# EAGLE board dsp_board_power_amplifier (EAGLE 9.6.2), part 1 of 2
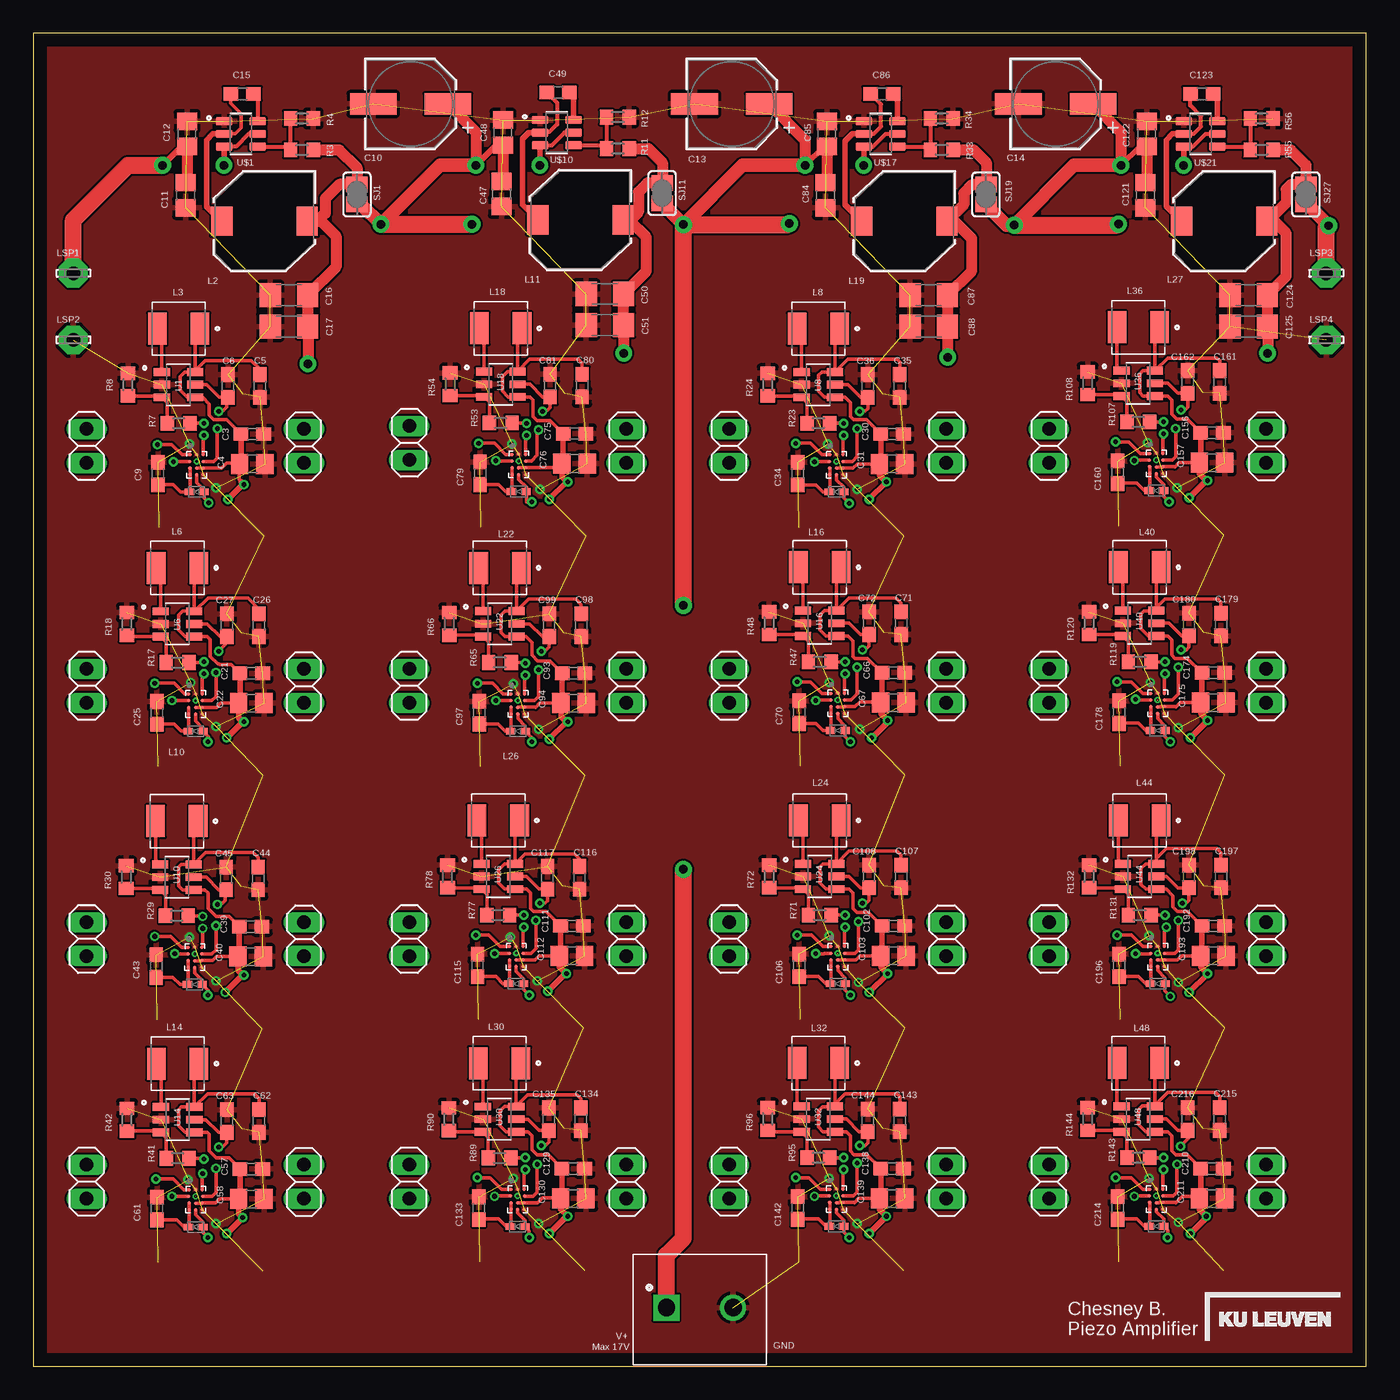
[diagram p7: board, top side]
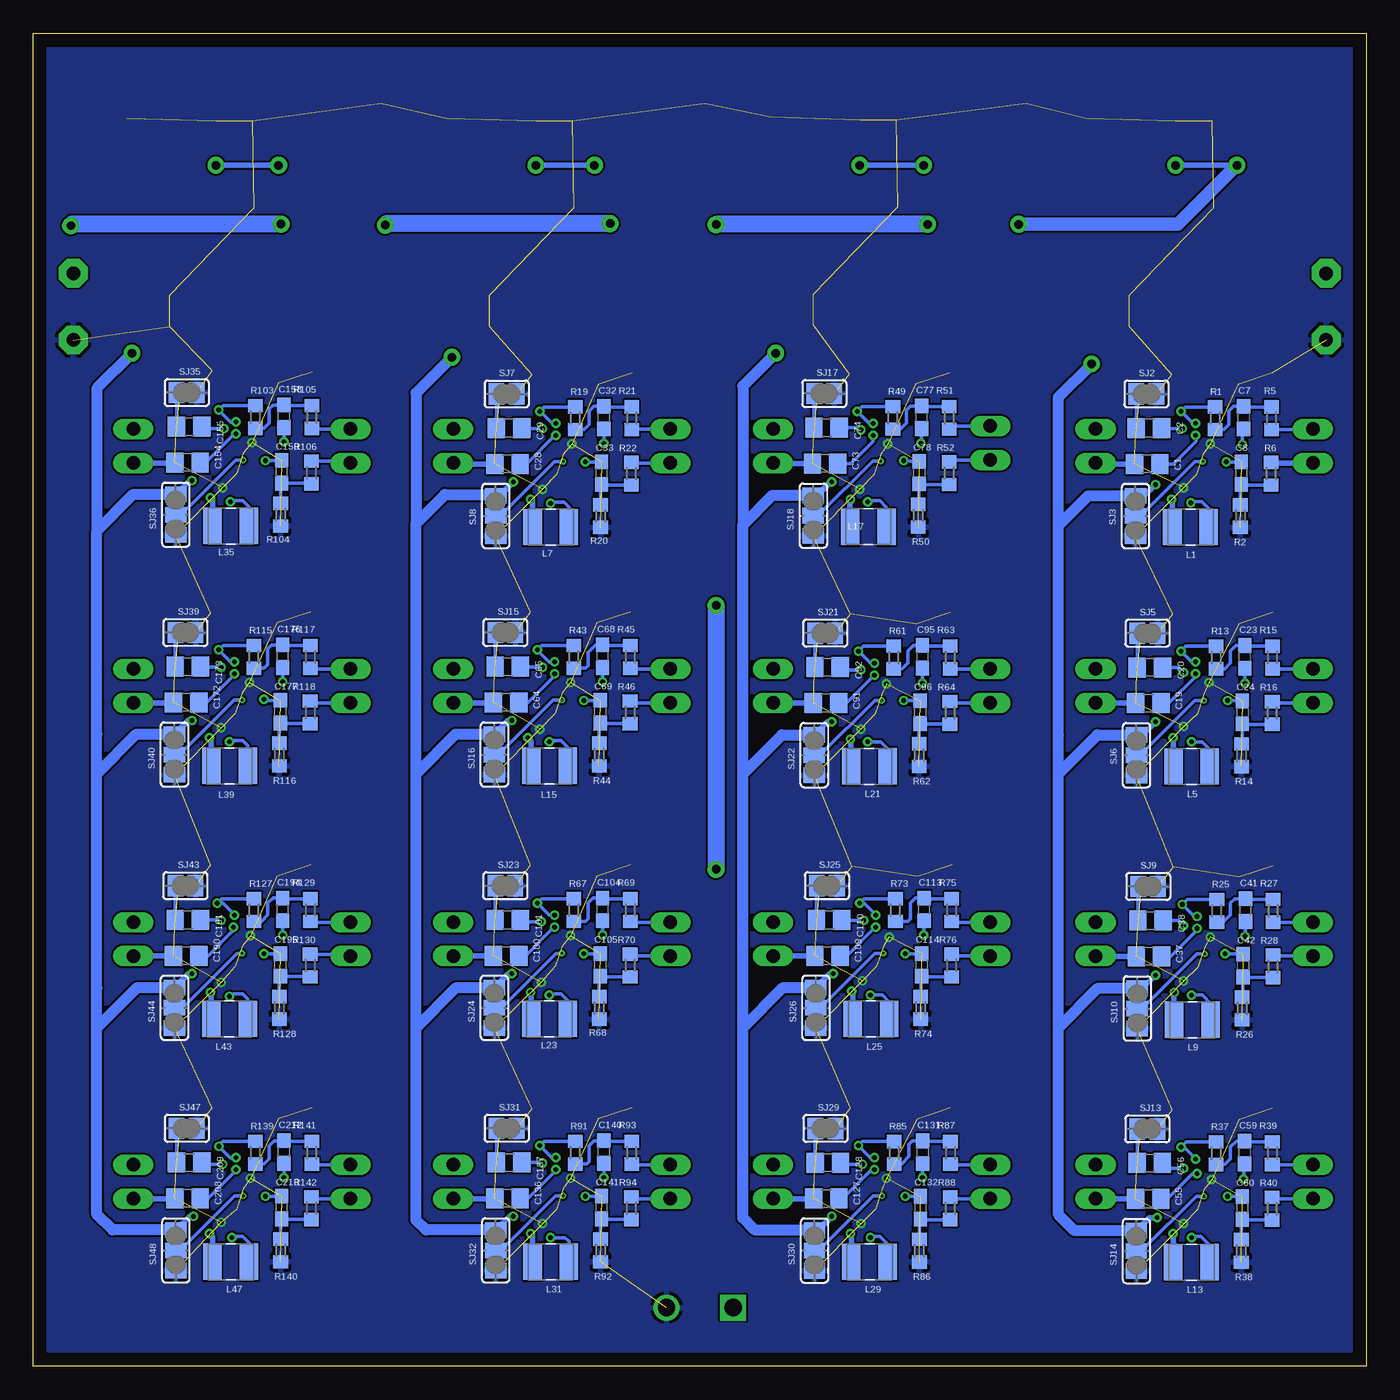
[diagram p8: board, bottom side, seen from below]

Size 100 x 100 mm. Coordinates in mm from the lower left corner, seen from the top.
Outline: 0,0 100,0 100,100 0,100 0,0
Copper layers (1*16): Top 0.035mm / dielectric 1.5mm / Bottom 0.035mm
Design rules "default *": minimum track width 6mil, minimum drill 0.35mm, track to track 6mil, track to pad 6mil, pad to pad 6mil, via to via 6mil, smd to smd 6mil, copper to edge 40mil, drill to drill 6mil, minimum pad ring 10mil, minimum via ring 5mil, stop-mask expansion 4mil, vias tented up to drill 0mil, thermal gap 10mil

## Footprints (pad centres in the part's own frame; a part is rotated, then mirrored left to right if it is on the bottom)
C0805 = smd 1.3 x 1.5: 1 -0.95,0; 2 0.95,0
C0603 = smd 1.1 x 1: 1 -0.85,0; 2 0.85,0
WCAP-ASLU_6.3X7.7(DXL) = smd 3.5 x 1.6: 1 2.8,0; 2 -2.8,0
C1206 = smd 1.6 x 1.8: 1 -1.4,0; 2 1.4,0
PHOENIX_1935161 = drill 1.3 square: 1 -2.5,0 | drill 1.3: 2 2.5,0
1X02 = drill 1.016 long: 1 -1.27,0; 2 1.27,0
INDC3225X170N = smd 1.39 x 2.72: 1 -1.365,0; 2 1.365,0
WE-PD_7345P = smd 1.6 x 2.2: 1 -3.2,0; 2 3.2,0
IND_FDSD0420-H-100M=P3 = smd 1.4 x 2.4: 1 -1.6,0; 2 1.6,0
LSP10 = drill 1.016 pad 2.159 octagon: MP 0,0
R0603 = smd 1 x 1.1: 1 -0.85,0; 2 0.85,0
SJ = smd 1.168 x 1.6: 1 -0.762,0; 2 0.762,0
SJ_2 = smd 1.168 x 1.6: 1 -1.524,0; 2 0,0; 3 1.524,0
SOT95P280X145-6N = smd 1.21 x 0.58: 1 -1.255,0.95; 2 -1.255,0; 3 -1.255,-0.95; 4 1.255,-0.95; 5 1.255,0; 6 1.255,0.95
BGA12N40P3X4_119X159X62N = smd 0.25 x 0.25: A1 -0.75,-0.5; A2 -0.76,0; A3 -0.75,0.5; B1 -0.25,-0.51; B2 -0.25,0; B3 -0.25,0.51; C1 0.25,-0.5; C2 0.26,0; C3 0.25,0.5; D1 0.75,-0.5; D2 0.75,0; D3 0.75,0.5
SOT95P280X110-6N = smd 1.25 x 0.59: 1 -1.255,0.95; 2 -1.255,0; 3 -1.255,-0.95; 4 1.255,-0.95; 5 1.255,0; 6 1.255,0.95
SOD523 = smd 0.7 x 0.5: 1 0.55,0; 2 -0.55,0

## Placement (x,y rotation side)
C1  1u@6.3V  [C0805]  16.43,67.7 0 bottom
C2  1u6.3V  [C0805]  16.31,70.38 0 bottom
C3  1u  [C0603]  16.43,69.93 0 top
C4  10u  [C0805]  16.43,67.69 0 top
C5  1u@10V  [C0603]  17,73.54 270 top
C6  4.7u@25V  [C0603]  14.6,73.54 90 top
C7  1u@35V  [C0603]  9.19,71.17 90 bottom
C8  1u@35V  [C0603]  9.37,67.01 270 bottom
C9  1u@25V  [C0603]  9.35,66.97 270 top
C10  100 µF  [WCAP-ASLU_6.3X7.7(DXL)]  28.3,94.7 0 top
C11  10u  [C0805]  11.43,87.85 270 top
C12  10u  [C0805]  11.53,92.45 90 top
C13  100 µF  [WCAP-ASLU_6.3X7.7(DXL)]  52.4,94.7 0 top
C14  100 µF  [WCAP-ASLU_6.3X7.7(DXL)]  76.7,94.7 0 top
C15  100n  [C0603]  15.67,95.46 180 top
C16  22u  [C1206]  19.18,80.35 180 top
C17  22u  [C1206]  19.18,78.01 180 top
C19  1u@6.3V  [C0805]  16.35,49.75 0 bottom
C20  1u6.3V  [C0805]  16.23,52.43 0 bottom
C21  1u  [C0603]  16.35,51.98 0 top
C22  10u  [C0805]  16.35,49.74 0 top
C23  1u@35V  [C0603]  9.11,53.22 90 bottom
C24  1u@35V  [C0603]  9.29,49.06 270 bottom
C25  1u@25V  [C0603]  9.27,49.02 270 top
C26  1u@10V  [C0603]  16.92,55.59 270 top
C27  4.7u@25V  [C0603]  14.52,55.59 90 top
C28  1u@6.3V  [C0805]  64.43,67.7 0 bottom
C29  1u6.3V  [C0805]  64.31,70.38 0 bottom
C30  1u  [C0603]  64.43,69.93 0 top
C31  10u  [C0805]  64.43,67.69 0 top
C32  1u@35V  [C0603]  57.19,71.17 90 bottom
C33  1u@35V  [C0603]  57.37,67.01 270 bottom
C34  1u@25V  [C0603]  57.35,66.97 270 top
C35  1u@10V  [C0603]  65,73.54 270 top
C36  4.7u@25V  [C0603]  62.6,73.54 90 top
C37  1u@6.3V  [C0805]  16.3,30.75 0 bottom
C38  1u6.3V  [C0805]  16.18,33.43 0 bottom
C39  1u  [C0603]  16.3,32.98 0 top
C40  10u  [C0805]  16.3,30.74 0 top
C41  1u@35V  [C0603]  9.06,34.22 90 bottom
C42  1u@35V  [C0603]  9.24,30.06 270 bottom
C43  1u@25V  [C0603]  9.22,30.02 270 top
C44  1u@10V  [C0603]  16.87,36.59 270 top
C45  4.7u@25V  [C0603]  14.47,36.59 90 top
C47  10u  [C0805]  35.13,87.95 270 top
C48  10u  [C0805]  35.23,92.55 90 top
C49  100n  [C0603]  39.37,95.56 180 top
C50  22u  [C1206]  42.88,80.45 180 top
C51  22u  [C1206]  42.88,78.11 180 top
C55  1u@6.3V  [C0805]  16.36,12.56 0 bottom
C56  1u6.3V  [C0805]  16.24,15.24 0 bottom
C57  1u  [C0603]  16.36,14.79 0 top
C58  10u  [C0805]  16.36,12.55 0 top
C59  1u@35V  [C0603]  9.12,16.03 90 bottom
C60  1u@35V  [C0603]  9.3,11.87 270 bottom
C61  1u@25V  [C0603]  9.28,11.83 270 top
C62  1u@10V  [C0603]  16.93,18.4 270 top
C63  4.7u@25V  [C0603]  14.53,18.4 90 top
C64  1u@6.3V  [C0805]  64.53,49.8 0 bottom
C65  1u6.3V  [C0805]  64.41,52.48 0 bottom
C66  1u  [C0603]  64.53,52.03 0 top
C67  10u  [C0805]  64.53,49.79 0 top
C68  1u@35V  [C0603]  57.29,53.27 90 bottom
C69  1u@35V  [C0603]  57.47,49.11 270 bottom
C70  1u@25V  [C0603]  57.45,49.07 270 top
C71  1u@10V  [C0603]  65.1,55.74 270 top
C72  4.7u@25V  [C0603]  62.7,55.74 90 top
C73  1u@6.3V  [C0805]  40.6,67.73 0 bottom
C74  1u6.3V  [C0805]  40.48,70.41 0 bottom
C75  1u  [C0603]  40.6,69.96 0 top
C76  10u  [C0805]  40.6,67.72 0 top
C77  1u@35V  [C0603]  33.36,71.2 90 bottom
C78  1u@35V  [C0603]  33.54,67.04 270 bottom
C79  1u@25V  [C0603]  33.52,67 270 top
C80  1u@10V  [C0603]  41.17,73.57 270 top
C81  4.7u@25V  [C0603]  38.77,73.57 90 top
C84  10u  [C0805]  59.43,87.85 270 top
C85  10u  [C0805]  59.53,92.45 90 top
C86  100n  [C0603]  63.67,95.46 180 top
C87  22u  [C1206]  67.18,80.35 180 top
C88  22u  [C1206]  67.18,78.01 180 top
C91  1u@6.3V  [C0805]  40.53,49.76 0 bottom
C92  1u6.3V  [C0805]  40.41,52.44 0 bottom
C93  1u  [C0603]  40.53,51.99 0 top
C94  10u  [C0805]  40.53,49.75 0 top
C95  1u@35V  [C0603]  33.29,53.23 90 bottom
C96  1u@35V  [C0603]  33.47,49.07 270 bottom
C97  1u@25V  [C0603]  33.45,49.03 270 top
C98  1u@10V  [C0603]  41.1,55.6 270 top
C99  4.7u@25V  [C0603]  38.7,55.6 90 top
C100  1u@6.3V  [C0805]  64.53,30.8 0 bottom
C101  1u6.3V  [C0805]  64.41,33.48 0 bottom
C102  1u  [C0603]  64.53,33.03 0 top
C103  10u  [C0805]  64.53,30.79 0 top
C104  1u@35V  [C0603]  57.29,34.27 90 bottom
C105  1u@35V  [C0603]  57.47,30.11 270 bottom
C106  1u@25V  [C0603]  57.45,30.07 270 top
C107  1u@10V  [C0603]  65.1,36.74 270 top
C108  4.7u@25V  [C0603]  62.7,36.74 90 top
C109  1u@6.3V  [C0805]  40.41,30.8 0 bottom
C110  1u6.3V  [C0805]  40.29,33.48 0 bottom
C111  1u  [C0603]  40.41,33.03 0 top
C112  10u  [C0805]  40.41,30.79 0 top
C113  1u@35V  [C0603]  33.17,34.27 90 bottom
C114  1u@35V  [C0603]  33.35,30.11 270 bottom
C115  1u@25V  [C0603]  33.33,30.07 270 top
C116  1u@10V  [C0603]  40.98,36.64 270 top
C117  4.7u@25V  [C0603]  38.58,36.64 90 top
C121  10u  [C0805]  83.43,87.85 270 top
C122  10u  [C0805]  83.53,92.45 90 top
C123  100n  [C0603]  87.67,95.46 180 top
C124  22u  [C1206]  91.18,80.35 180 top
C125  22u  [C1206]  91.18,78.01 180 top
C127  1u@6.3V  [C0805]  40.51,12.59 0 bottom
C128  1u6.3V  [C0805]  40.39,15.27 0 bottom
C129  1u  [C0603]  40.51,14.82 0 top
C130  10u  [C0805]  40.51,12.58 0 top
C131  1u@35V  [C0603]  33.27,16.06 90 bottom
C132  1u@35V  [C0603]  33.45,11.9 270 bottom
C133  1u@25V  [C0603]  33.43,11.86 270 top
C134  1u@10V  [C0603]  41.08,18.53 270 top
C135  4.7u@25V  [C0603]  38.68,18.53 90 top
C136  1u@6.3V  [C0805]  64.43,12.6 0 bottom
C137  1u6.3V  [C0805]  64.31,15.28 0 bottom
C138  1u  [C0603]  64.43,14.83 0 top
C139  10u  [C0805]  64.43,12.59 0 top
C140  1u@35V  [C0603]  57.19,16.07 90 bottom
C141  1u@35V  [C0603]  57.37,11.91 270 bottom
C142  1u@25V  [C0603]  57.35,11.87 270 top
C143  1u@10V  [C0603]  65,18.44 270 top
C144  4.7u@25V  [C0603]  62.6,18.44 90 top
C154  1u@6.3V  [C0805]  88.43,67.8 0 bottom
C155  1u6.3V  [C0805]  88.31,70.48 0 bottom
C156  1u  [C0603]  88.43,70.03 0 top
C157  10u  [C0805]  88.43,67.79 0 top
C158  1u@35V  [C0603]  81.19,71.27 90 bottom
C159  1u@35V  [C0603]  81.37,67.11 270 bottom
C160  1u@25V  [C0603]  81.35,67.07 270 top
C161  1u@10V  [C0603]  89,73.84 270 top
C162  4.7u@25V  [C0603]  86.6,73.84 90 top
C172  1u@6.3V  [C0805]  88.53,49.8 0 bottom
C173  1u6.3V  [C0805]  88.41,52.48 0 bottom
C174  1u  [C0603]  88.53,52.03 0 top
C175  10u  [C0805]  88.53,49.79 0 top
C176  1u@35V  [C0603]  81.29,53.27 90 bottom
C177  1u@35V  [C0603]  81.47,49.11 270 bottom
C178  1u@25V  [C0603]  81.45,49.07 270 top
C179  1u@10V  [C0603]  89.1,55.64 270 top
C180  4.7u@25V  [C0603]  86.7,55.64 90 top
C190  1u@6.3V  [C0805]  88.53,30.8 0 bottom
C191  1u6.3V  [C0805]  88.41,33.48 0 bottom
C192  1u  [C0603]  88.53,33.03 0 top
C193  10u  [C0805]  88.53,30.79 0 top
C194  1u@35V  [C0603]  81.29,34.27 90 bottom
C195  1u@35V  [C0603]  81.47,30.11 270 bottom
C196  1u@25V  [C0603]  81.45,30.07 270 top
C197  1u@10V  [C0603]  89.1,36.74 270 top
C198  4.7u@25V  [C0603]  86.7,36.74 90 top
C208  1u@6.3V  [C0805]  88.43,12.6 0 bottom
C209  1u6.3V  [C0805]  88.31,15.28 0 bottom
C210  1u  [C0603]  88.43,14.83 0 top
C211  10u  [C0805]  88.43,12.59 0 top
C212  1u@35V  [C0603]  81.19,16.07 90 bottom
C213  1u@35V  [C0603]  81.37,11.91 270 bottom
C214  1u@25V  [C0603]  81.35,11.87 270 top
C215  1u@10V  [C0603]  89,18.54 270 top
C216  4.7u@25V  [C0603]  86.6,18.54 90 top
INPUT  1935161  [PHOENIX_1935161]  50,4.4 0 top
JP1  [1X02]  20.3,69.04 90 top
JP2  [1X02]  4,69.04 270 top
JP5  [1X02]  20.3,51.04 90 top
JP6  [1X02]  4,51.04 270 top
JP7  [1X02]  68.5,69.04 90 top
JP8  [1X02]  52.2,69.04 270 top
JP9  [1X02]  20.3,32.04 90 top
JP10  [1X02]  4,32.04 270 top
JP13  [1X02]  20.3,13.84 90 top
JP14  [1X02]  4,13.84 270 top
JP15  [1X02]  68.5,51.04 90 top
JP16  [1X02]  52.2,51.04 270 top
JP17  [1X02]  44.5,69.04 90 top
JP18  [1X02]  28.2,69.27 270 top
JP21  [1X02]  44.5,51.04 90 top
JP22  [1X02]  28.2,51.04 270 top
JP23  [1X02]  68.5,32.04 90 top
JP24  [1X02]  52.2,32.04 270 top
JP25  [1X02]  44.5,32.04 90 top
JP26  [1X02]  28.2,32.04 270 top
JP29  [1X02]  44.5,13.84 90 top
JP30  [1X02]  28.2,13.84 270 top
JP31  [1X02]  68.5,13.84 90 top
JP32  [1X02]  52.2,13.84 270 top
JP35  [1X02]  92.5,69.04 90 top
JP36  [1X02]  76.2,69.04 270 top
JP39  [1X02]  92.5,51.04 90 top
JP40  [1X02]  76.2,51.04 270 top
JP43  [1X02]  92.5,32.04 90 top
JP44  [1X02]  76.2,32.04 270 top
JP47  [1X02]  92.5,13.84 90 top
JP48  [1X02]  76.2,13.84 270 top
L1  BRL3225T4R7M 4.7u  [INDC3225X170N]  13.18,62.95 0 bottom
L2  3.3uH  [WE-PD_7345P]  17.34,85.9 0 top
L3  FDSD0420-H-100M=P3  [IND_FDSD0420-H-100M=P3]  10.9,77.84 180 top
L5  BRL3225T4R7M 4.7u  [INDC3225X170N]  13.1,45 0 bottom
L6  FDSD0420-H-100M=P3  [IND_FDSD0420-H-100M=P3]  10.82,59.89 180 top
L7  BRL3225T4R7M 4.7u  [INDC3225X170N]  61.18,62.95 0 bottom
L8  FDSD0420-H-100M=P3  [IND_FDSD0420-H-100M=P3]  58.9,77.84 180 top
L9  BRL3225T4R7M 4.7u  [INDC3225X170N]  13.05,26 0 bottom
L10  FDSD0420-H-100M=P3  [IND_FDSD0420-H-100M=P3]  10.77,40.89 180 top
L11  3.3uH  [WE-PD_7345P]  41.04,86 0 top
L13  BRL3225T4R7M 4.7u  [INDC3225X170N]  13.11,7.81 0 bottom
L14  FDSD0420-H-100M=P3  [IND_FDSD0420-H-100M=P3]  10.83,22.7 180 top
L15  BRL3225T4R7M 4.7u  [INDC3225X170N]  61.28,45.05 0 bottom
L16  FDSD0420-H-100M=P3  [IND_FDSD0420-H-100M=P3]  59,59.94 180 top
L17  BRL3225T4R7M 4.7u  [INDC3225X170N]  37.35,62.98 0 bottom
L18  FDSD0420-H-100M=P3  [IND_FDSD0420-H-100M=P3]  35.07,77.87 180 top
L19  3.3uH  [WE-PD_7345P]  65.34,85.9 0 top
L21  BRL3225T4R7M 4.7u  [INDC3225X170N]  37.28,45.01 0 bottom
L22  FDSD0420-H-100M=P3  [IND_FDSD0420-H-100M=P3]  35,59.9 180 top
L23  BRL3225T4R7M 4.7u  [INDC3225X170N]  61.28,26.05 0 bottom
L24  FDSD0420-H-100M=P3  [IND_FDSD0420-H-100M=P3]  59,40.94 180 top
L25  BRL3225T4R7M 4.7u  [INDC3225X170N]  37.16,26.05 0 bottom
L26  FDSD0420-H-100M=P3  [IND_FDSD0420-H-100M=P3]  34.88,40.94 180 top
L27  3.3uH  [WE-PD_7345P]  89.34,85.9 0 top
L29  BRL3225T4R7M 4.7u  [INDC3225X170N]  37.26,7.84 0 bottom
L30  FDSD0420-H-100M=P3  [IND_FDSD0420-H-100M=P3]  34.98,22.73 180 top
L31  BRL3225T4R7M 4.7u  [INDC3225X170N]  61.18,7.85 0 bottom
L32  FDSD0420-H-100M=P3  [IND_FDSD0420-H-100M=P3]  58.9,22.74 180 top
L35  BRL3225T4R7M 4.7u  [INDC3225X170N]  85.18,63.05 0 bottom
L36  FDSD0420-H-100M=P3  [IND_FDSD0420-H-100M=P3]  82.9,77.94 180 top
L39  BRL3225T4R7M 4.7u  [INDC3225X170N]  85.28,45.05 0 bottom
L40  FDSD0420-H-100M=P3  [IND_FDSD0420-H-100M=P3]  83,59.94 180 top
L43  BRL3225T4R7M 4.7u  [INDC3225X170N]  85.28,26.05 0 bottom
L44  FDSD0420-H-100M=P3  [IND_FDSD0420-H-100M=P3]  83,40.94 180 top
L47  BRL3225T4R7M 4.7u  [INDC3225X170N]  85.18,7.85 0 bottom
L48  FDSD0420-H-100M=P3  [IND_FDSD0420-H-100M=P3]  82.9,22.74 180 top
LSP1  LSP10  [LSP10]  3,82 0 top
LSP2  LSP10  [LSP10]  3,77 0 top
LSP3  LSP10  [LSP10]  97,82 0 top
LSP4  LSP10  [LSP10]  97,77 0 top
R1  10k  [R0603]  11.34,71.12 90 bottom
R2  10k  [R0603]  9.44,63.78 90 bottom
R3  33k  [R0603]  20.15,91.25 0 top
R4  10k  [R0603]  20.15,93.61 180 top
R5  10  [R0603]  7.11,71.12 270 bottom
R6  10  [R0603]  7.13,66.96 90 bottom
R7  18k  [R0603]  10.9,70.74 0 top
R8  1k  [R0603]  7.1,73.64 270 top
R11  33k  [R0603]  43.85,91.35 0 top
R12  10k  [R0603]  43.85,93.71 180 top
R13  10k  [R0603]  11.26,53.17 90 bottom
R14  10k  [R0603]  9.36,45.83 90 bottom
R15  10  [R0603]  7.03,53.17 270 bottom
R16  10  [R0603]  7.05,49.01 90 bottom
R17  18k  [R0603]  10.82,52.79 0 top
R18  1k  [R0603]  7.02,55.69 270 top
R19  10k  [R0603]  59.34,71.12 90 bottom
R20  10k  [R0603]  57.44,63.78 90 bottom
R21  10  [R0603]  55.11,71.12 270 bottom
R22  10  [R0603]  55.13,66.96 90 bottom
R23  18k  [R0603]  58.9,70.74 0 top
R24  1k  [R0603]  55.1,73.64 270 top
R25  10k  [R0603]  11.21,34.17 90 bottom
R26  10k  [R0603]  9.31,26.83 90 bottom
R27  10  [R0603]  6.98,34.17 270 bottom
R28  10  [R0603]  7,30.01 90 bottom
R29  18k  [R0603]  10.77,33.79 0 top
R30  1k  [R0603]  6.97,36.69 270 top
R33  33k  [R0603]  68.15,91.25 0 top
R34  10k  [R0603]  68.15,93.61 180 top
R37  10k  [R0603]  11.27,15.98 90 bottom
R38  10k  [R0603]  9.37,8.64 90 bottom
R39  10  [R0603]  7.04,15.98 270 bottom
R40  10  [R0603]  7.06,11.82 90 bottom
R41  18k  [R0603]  10.83,15.6 0 top
R42  1k  [R0603]  7.03,18.5 270 top
R43  10k  [R0603]  59.44,53.22 90 bottom
R44  10k  [R0603]  57.54,45.88 90 bottom
R45  10  [R0603]  55.21,53.22 270 bottom
R46  10  [R0603]  55.23,49.06 90 bottom
R47  18k  [R0603]  59,52.84 0 top
R48  1k  [R0603]  55.2,55.74 270 top
R49  10k  [R0603]  35.51,71.15 90 bottom
R50  10k  [R0603]  33.61,63.81 90 bottom
R51  10  [R0603]  31.28,71.15 270 bottom
R52  10  [R0603]  31.3,66.99 90 bottom
R53  18k  [R0603]  35.07,70.77 0 top
R54  1k  [R0603]  31.27,73.67 270 top
R55  33k  [R0603]  92.15,91.25 0 top
R56  10k  [R0603]  92.15,93.61 180 top
R61  10k  [R0603]  35.44,53.18 90 bottom
R62  10k  [R0603]  33.54,45.84 90 bottom
R63  10  [R0603]  31.21,53.18 270 bottom
R64  10  [R0603]  31.23,49.02 90 bottom
R65  18k  [R0603]  35,52.8 0 top
R66  1k  [R0603]  31.2,55.7 270 top
R67  10k  [R0603]  59.44,34.22 90 bottom
R68  10k  [R0603]  57.54,26.88 90 bottom
R69  10  [R0603]  55.21,34.22 270 bottom
R70  10  [R0603]  55.23,30.06 90 bottom
R71  18k  [R0603]  59,33.84 0 top
R72  1k  [R0603]  55.2,36.74 270 top
R73  10k  [R0603]  35.32,34.22 90 bottom
R74  10k  [R0603]  33.42,26.88 90 bottom
R75  10  [R0603]  31.09,34.22 270 bottom
R76  10  [R0603]  31.11,30.06 90 bottom
R77  18k  [R0603]  34.88,33.84 0 top
R78  1k  [R0603]  31.08,36.74 270 top
R85  10k  [R0603]  35.42,16.01 90 bottom
R86  10k  [R0603]  33.52,8.67 90 bottom
R87  10  [R0603]  31.19,16.01 270 bottom
R88  10  [R0603]  31.21,11.85 90 bottom
R89  18k  [R0603]  34.98,15.63 0 top
R90  1k  [R0603]  31.18,18.53 270 top
R91  10k  [R0603]  59.34,16.02 90 bottom
R92  10k  [R0603]  57.44,8.68 90 bottom
R93  10  [R0603]  55.11,16.02 270 bottom
R94  10  [R0603]  55.13,11.86 90 bottom
R95  18k  [R0603]  58.9,15.64 0 top
R96  1k  [R0603]  55.1,18.54 270 top
R103  10k  [R0603]  83.34,71.22 90 bottom
R104  10k  [R0603]  81.44,63.88 90 bottom
R105  10  [R0603]  79.11,71.22 270 bottom
R106  10  [R0603]  79.13,67.06 90 bottom
R107  18k  [R0603]  82.9,70.84 0 top
R108  1k  [R0603]  79.1,73.74 270 top
R115  10k  [R0603]  83.44,53.22 90 bottom
R116  10k  [R0603]  81.54,45.88 90 bottom
R117  10  [R0603]  79.21,53.22 270 bottom
R118  10  [R0603]  79.23,49.06 90 bottom
R119  18k  [R0603]  83,52.84 0 top
R120  1k  [R0603]  79.2,55.74 270 top
R127  10k  [R0603]  83.44,34.22 90 bottom
R128  10k  [R0603]  81.54,26.88 90 bottom
R129  10  [R0603]  79.21,34.22 270 bottom
R130  10  [R0603]  79.23,30.06 90 bottom
R131  18k  [R0603]  83,33.84 0 top
R132  1k  [R0603]  79.2,36.74 270 top
R139  10k  [R0603]  83.34,16.02 90 bottom
R140  10k  [R0603]  81.44,8.68 90 bottom
R141  10  [R0603]  79.11,16.02 270 bottom
R142  10  [R0603]  79.13,11.86 90 bottom
R143  18k  [R0603]  82.9,15.64 0 top
R144  1k  [R0603]  79.1,18.54 270 top
SJ1  [SJ]  24.28,87.91 90 top
SJ2  [SJ]  16.49,72.94 180 bottom
SJ3  [SJ_2]  17.31,63.79 270 bottom
SJ5  [SJ]  16.41,54.99 180 bottom
SJ6  [SJ_2]  17.23,45.84 270 bottom
SJ7  [SJ]  64.49,72.94 180 bottom
SJ8  [SJ_2]  65.31,63.79 270 bottom
SJ9  [SJ]  16.36,35.99 180 bottom
SJ10  [SJ_2]  17.18,26.84 270 bottom
SJ11  [SJ]  47.18,88.01 90 top
SJ13  [SJ]  16.42,17.8 180 bottom
SJ14  [SJ_2]  17.24,8.65 270 bottom
SJ15  [SJ]  64.59,55.04 180 bottom
SJ16  [SJ_2]  65.41,45.89 270 bottom
SJ17  [SJ]  40.66,72.97 180 bottom
SJ18  [SJ_2]  41.48,63.82 270 bottom
SJ19  [SJ]  71.48,87.91 90 top
SJ21  [SJ]  40.59,55 180 bottom
SJ22  [SJ_2]  41.41,45.85 270 bottom
SJ23  [SJ]  64.59,36.04 180 bottom
SJ24  [SJ_2]  65.41,26.89 270 bottom
SJ25  [SJ]  40.47,36.04 180 bottom
SJ26  [SJ_2]  41.29,26.89 270 bottom
SJ27  [SJ]  95.48,87.91 90 top
SJ29  [SJ]  40.57,17.83 180 bottom
SJ30  [SJ_2]  41.39,8.68 270 bottom
SJ31  [SJ]  64.49,17.84 180 bottom
SJ32  [SJ_2]  65.31,8.69 270 bottom
SJ35  [SJ]  88.49,73.04 180 bottom
SJ36  [SJ_2]  89.31,63.89 270 bottom
SJ39  [SJ]  88.59,55.04 180 bottom
SJ40  [SJ_2]  89.41,45.89 270 bottom
SJ43  [SJ]  88.59,36.04 180 bottom
SJ44  [SJ_2]  89.41,26.89 270 bottom
SJ47  [SJ]  88.49,17.84 180 bottom
SJ48  [SJ_2]  89.31,8.69 270 bottom
U1  TLV61046ADBVR  [SOT95P280X145-6N]  10.9,73.64 0 top
U2  LM48580  [BGA12N40P3X4_119X159X62N]  12.25,67.63 270 top
U5  LM48580  [BGA12N40P3X4_119X159X62N]  12.17,49.68 270 top
U6  TLV61046ADBVR  [SOT95P280X145-6N]  10.82,55.69 0 top
U7  LM48580  [BGA12N40P3X4_119X159X62N]  60.25,67.63 270 top
U8  TLV61046ADBVR  [SOT95P280X145-6N]  58.9,73.64 0 top
U9  LM48580  [BGA12N40P3X4_119X159X62N]  12.12,30.68 270 top
U10  TLV61046ADBVR  [SOT95P280X145-6N]  10.77,36.69 0 top
U13  LM48580  [BGA12N40P3X4_119X159X62N]  12.18,12.49 270 top
U14  TLV61046ADBVR  [SOT95P280X145-6N]  10.83,18.5 0 top
U15  LM48580  [BGA12N40P3X4_119X159X62N]  60.35,49.73 270 top
U16  TLV61046ADBVR  [SOT95P280X145-6N]  59,55.74 0 top
U17  LM48580  [BGA12N40P3X4_119X159X62N]  36.42,67.66 270 top
U18  TLV61046ADBVR  [SOT95P280X145-6N]  35.07,73.67 0 top
U21  LM48580  [BGA12N40P3X4_119X159X62N]  36.35,49.69 270 top
U22  TLV61046ADBVR  [SOT95P280X145-6N]  35,55.7 0 top
U23  LM48580  [BGA12N40P3X4_119X159X62N]  60.35,30.73 270 top
U24  TLV61046ADBVR  [SOT95P280X145-6N]  59,36.74 0 top
U25  LM48580  [BGA12N40P3X4_119X159X62N]  36.23,30.73 270 top
U26  TLV61046ADBVR  [SOT95P280X145-6N]  34.88,36.74 0 top
U29  LM48580  [BGA12N40P3X4_119X159X62N]  36.33,12.52 270 top
U30  TLV61046ADBVR  [SOT95P280X145-6N]  34.98,18.53 0 top
U31  LM48580  [BGA12N40P3X4_119X159X62N]  60.25,12.53 270 top
U32  TLV61046ADBVR  [SOT95P280X145-6N]  58.9,18.54 0 top
U35  LM48580  [BGA12N40P3X4_119X159X62N]  84.25,67.73 270 top
U36  TLV61046ADBVR  [SOT95P280X145-6N]  82.9,73.74 0 top
U39  LM48580  [BGA12N40P3X4_119X159X62N]  84.35,49.73 270 top
U40  TLV61046ADBVR  [SOT95P280X145-6N]  83,55.74 0 top
U43  LM48580  [BGA12N40P3X4_119X159X62N]  84.35,30.73 270 top
U44  TLV61046ADBVR  [SOT95P280X145-6N]  83,36.74 0 top
U47  LM48580  [BGA12N40P3X4_119X159X62N]  84.25,12.53 270 top
U48  TLV61046ADBVR  [SOT95P280X145-6N]  82.9,18.54 0 top
U$1  TPS562209  [SOT95P280X110-6N]  15.57,92.45 0 top
U$2  NSR0520V2T1G  [SOD523]  12.25,65.59 180 top
U$3  NSR0520V2T1G  [SOD523]  12.17,47.64 180 top
U$4  NSR0520V2T1G  [SOD523]  60.25,65.59 180 top
U$5  NSR0520V2T1G  [SOD523]  12.12,28.64 180 top
U$7  NSR0520V2T1G  [SOD523]  12.18,10.45 180 top
U$8  NSR0520V2T1G  [SOD523]  60.35,47.69 180 top
U$9  NSR0520V2T1G  [SOD523]  36.42,65.62 180 top
U$10  TPS562209  [SOT95P280X110-6N]  39.27,92.55 0 top
U$11  NSR0520V2T1G  [SOD523]  36.35,47.65 180 top
U$12  NSR0520V2T1G  [SOD523]  60.35,28.69 180 top
U$13  NSR0520V2T1G  [SOD523]  36.23,28.69 180 top
U$15  NSR0520V2T1G  [SOD523]  36.33,10.48 180 top
U$16  NSR0520V2T1G  [SOD523]  60.25,10.49 180 top
U$17  TPS562209  [SOT95P280X110-6N]  63.57,92.45 0 top
U$18  NSR0520V2T1G  [SOD523]  84.25,65.69 180 top
U$20  NSR0520V2T1G  [SOD523]  84.35,47.69 180 top
U$21  TPS562209  [SOT95P280X110-6N]  87.57,92.45 0 top
U$22  NSR0520V2T1G  [SOD523]  84.35,28.69 180 top
U$24  NSR0520V2T1G  [SOD523]  84.25,10.49 180 top